# Altium schematic sheet Specificaciya.SchDoc
size 209 x 297 mm
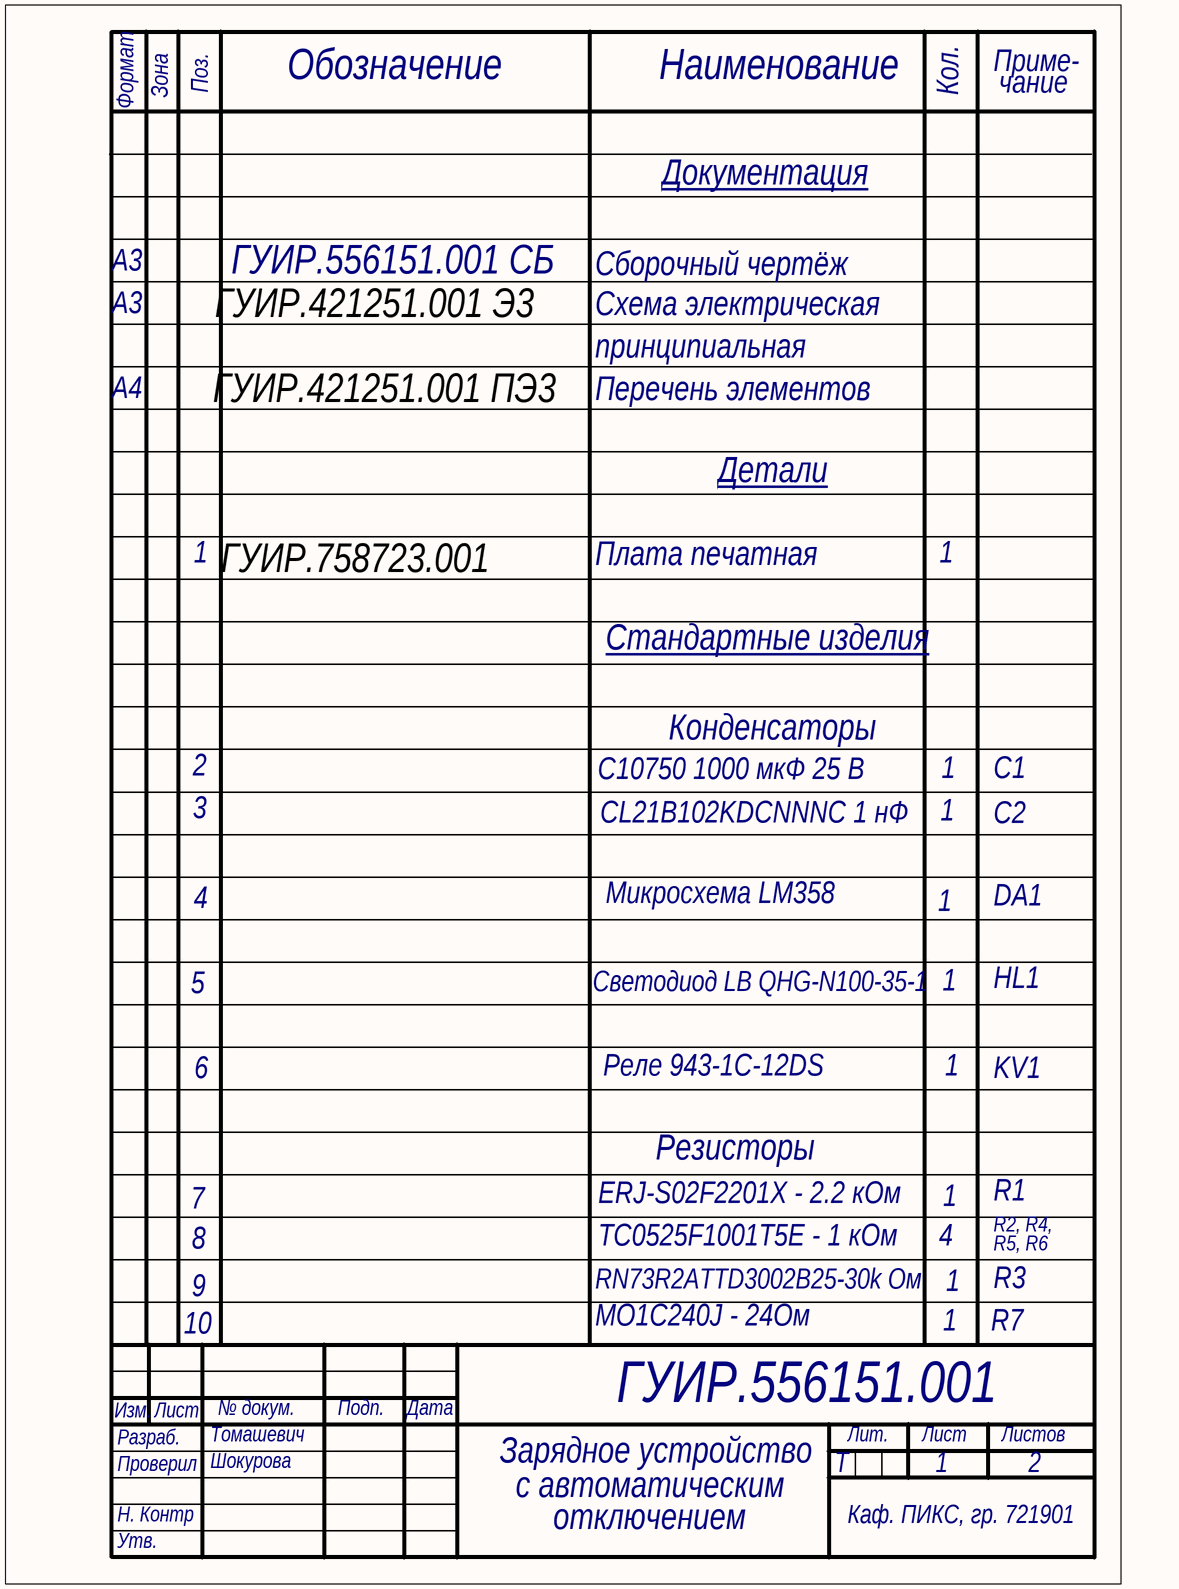
[diagram p0: Specificaciya.SchDoc]

## Notes on the sheet
- Формат
- Зона
- Поз.
- Обозначение
- Наименование
- Кол.
- Приме-
- чание
- Документация
- А3
- ГУИР.556151.001 СБ
- ГУИР.421251.001 Э3
- Сборочный чертёж
- Схема электрическая
- ГУИР.421251.001 ПЭ3
- принципиальная
- А4
- Перечень элементов
- Детали
- 1
- ГУИР.758723.001
- Плата печатная
- Стандартные изделия
- 2
- C10750 1000 мкФ 25 В
- Конденсаторы
- С1
- 3
- CL21B102KDCNNNC 1 нФ
- С2
- 4
- Микросхема LM358
- DA1
- 5
- Светодиод LB QHG-N100-35-1
- HL1
- 6
- Реле 943-1C-12DS
- KV1
- ERJ-S02F2201X - 2.2 кОм
- Резисторы
- R1
- 7
- 8
- TC0525F1001T5E - 1 кОм
- R2, R4,
- R5, R6
- 10
- 9
- MO1C240J - 24Ом
- RN73R2ATTD3002B25-30k Ом
- R7
- R3
- Изм.
- Разраб.
- Проверил
- Лист
- Томашевич
- Шокурова
- № докум.
- Подп.
- Дата
- Зарядное устройство
- ГУИР.556151.001
- Т
- Лит.
- Листов
- Н. Контр
- с автоматическим
- отключением
- Каф. ПИКС, гр. 721901
- Утв.